# Altium schematic sheet BSPD.SchDoc: =DocumentName
size A4; Organization: Queen's Formula SAE; Address1: 130 Stuart St, Kingston; Address2: Ontario; Address3: Canada; Address4: K7L 2V9; DocumentNumber: 1; Revision: 0; SheetNumber: 1; SheetTotal: 1
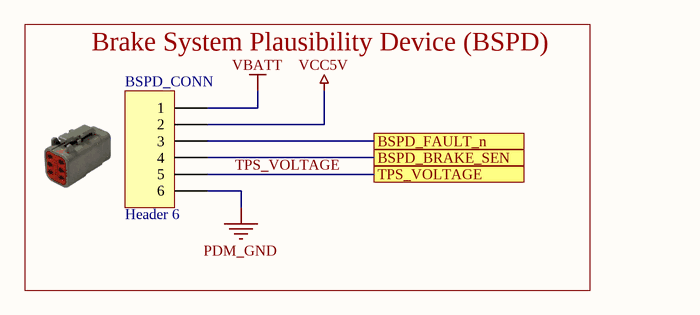
[diagram p0: BSPD.SchDoc]

## Parts
BSPD_CONN  Header 6  [HDR1X6]

## Blocks framed on the sheet
Brake System Plausibility Device (BSPD): BSPD_CONN

## Ports
BSPD_BRAKE_SEN, BSPD_FAULT_n, TPS_VOLTAGE

## Nets
PDM_GND: BSPD_CONN.6
VBATT: BSPD_CONN.1
VCC5V: BSPD_CONN.2
BSPD_BRAKE_SEN: BSPD_CONN.4 ; port BSPD_BRAKE_SEN
BSPD_FAULT_n: BSPD_CONN.3 ; port BSPD_FAULT_n
TPS_VOLTAGE: BSPD_CONN.5 ; port TPS_VOLTAGE

## Notes on the sheet
- Title
- Size:
- Date:
- A4
- Number:
- Time:
- Revision:
- Sheet
- of
- File:

## Library data of the parts
BSPD_CONN = Header 6: Header, 6-Pin; LatestRevisionDate: 17-Jul-2002; LatestRevisionNote: Re-released for DXP Platform.; Publisher: Altium Limited